# Altium schematic sheet 电机驱动SCH.SchDoc
size A4
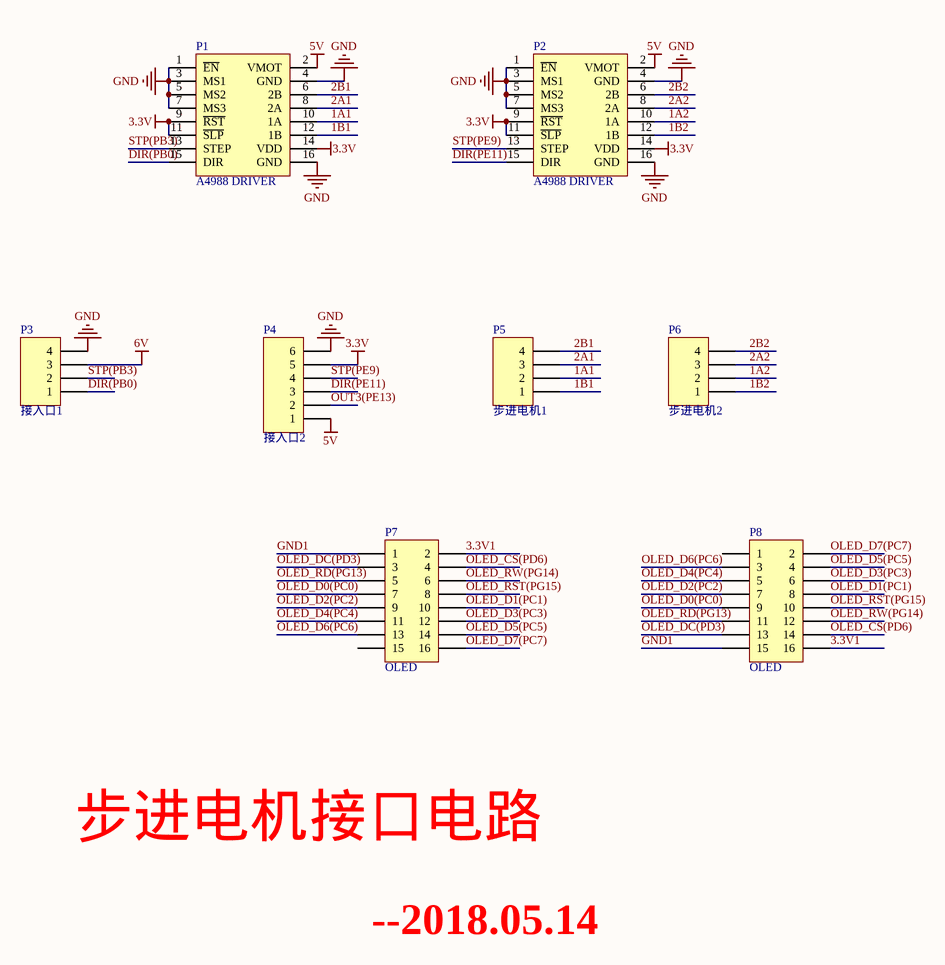
[diagram p0: 电机驱动SCH.SchDoc]

## Parts
P1  A4988 DRIVER  [A4988]
P2  A4988 DRIVER  [A4988]
P3  接入口1  [HDR1X4]
P4  接入口2  [HDR1X6]
P5  步进电机1  [HDR1X4]
P6  步进电机2  [HDR1X4]
P7  OLED  [HDR2X8]
P8  OLED  [HDR2X8]

## Nets
3.3V: P1.9(~{RST}) P1.11(~{SLP}) P1.14(VDD) P2.9(~{RST}) P2.11(~{SLP}) P2.14(VDD) P4.5
5V: P1.2(VMOT) P2.2(VMOT) P4.1
6V: P3.3
GND: P1.1(~{EN}) P1.3(MS1) P1.4(GND) P1.5(MS2) P1.7(MS3) P1.16(GND) P2.1(~{EN}) P2.3(MS1) P2.4(GND) P2.5(MS2) P2.7(MS3) P2.16(GND) P3.4 P4.6
1A1: P1.10(1A) P5.2
1A2: P2.10(1A) P6.2
1B1: P1.12(1B) P5.1
1B2: P2.12(1B) P6.1
2A1: P1.8(2A) P5.3
2A2: P2.8(2A) P6.3
2B1: P1.6(2B) P5.4
2B2: P2.6(2B) P6.4
3.3V1: P7.2 P8.16
DIR(PB0): P1.15(DIR) P3.1
DIR(PE11): P2.15(DIR) P4.3
GND1: P7.1 P8.15
OLED_CS(PD6): P7.4 P8.14
OLED_D0(PC0): P7.7 P8.9
OLED_D1(PC1): P7.10 P8.8
OLED_D2(PC2): P7.9 P8.7
OLED_D3(PC3): P7.12 P8.6
OLED_D4(PC4): P7.11 P8.5
OLED_D5(PC5): P7.14 P8.4
OLED_D6(PC6): P7.13 P8.3
OLED_D7(PC7): P7.16 P8.2
OLED_DC(PD3): P7.3 P8.13
OLED_RD(PG13): P7.5 P8.11
OLED_RST(PG15): P7.8 P8.10
OLED_RW(PG14): P7.6 P8.12
OUT3(PE13): P4.2
STP(PB3): P1.13(STEP) P3.2
STP(PE9): P2.13(STEP) P4.4

Not connected (* = marked no-connect by the designer): P7 15; P8 1

## Notes on the sheet
- 步进电机接口电路
- --2018.05.14

## Library data of the parts
P1 P2 = A4988 DRIVER: A4988步进电机驱动模块
P3 P5 P6 = Header 4: Header, 4-Pin; LatestRevisionDate: 17-Jul-2002; LatestRevisionNote: Re-released for DXP Platform.; Publisher: Altium Limited
P4 = Header 6: Header, 6-Pin; LatestRevisionDate: 17-Jul-2002; LatestRevisionNote: Re-released for DXP Platform.; Publisher: Altium Limited
P7 P8 = Header 8X2: Header, 8-Pin, Dual row; LatestRevisionDate: 17-Jul-2002; LatestRevisionNote: Re-released for DXP Platform.; Publisher: Altium Limited